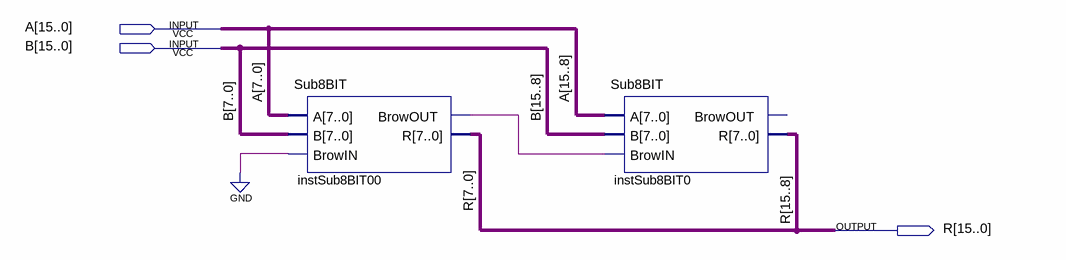
[diagram p0: schematic sheet]
// Quartus schematic Sub16BIT.bdf as structural Verilog: 2 symbols, 3 pins
module Sub16BIT (
  input  [15:0] A,
  input  [15:0] B,
  output [15:0] R
);

  wire instSub8BIT00_browout;

  Sub8BIT instSub8BIT00 (.A(A[7:0]), .B(B[7:0]), .BrowIN(1'b0), .BrowOUT(instSub8BIT00_browout), .R(R[7:0]));
  Sub8BIT instSub8BIT0 (.A(A[15:8]), .B(B[15:8]), .BrowIN(instSub8BIT00_browout), .R(R[15:8]));  // open: BrowOUT
endmodule
